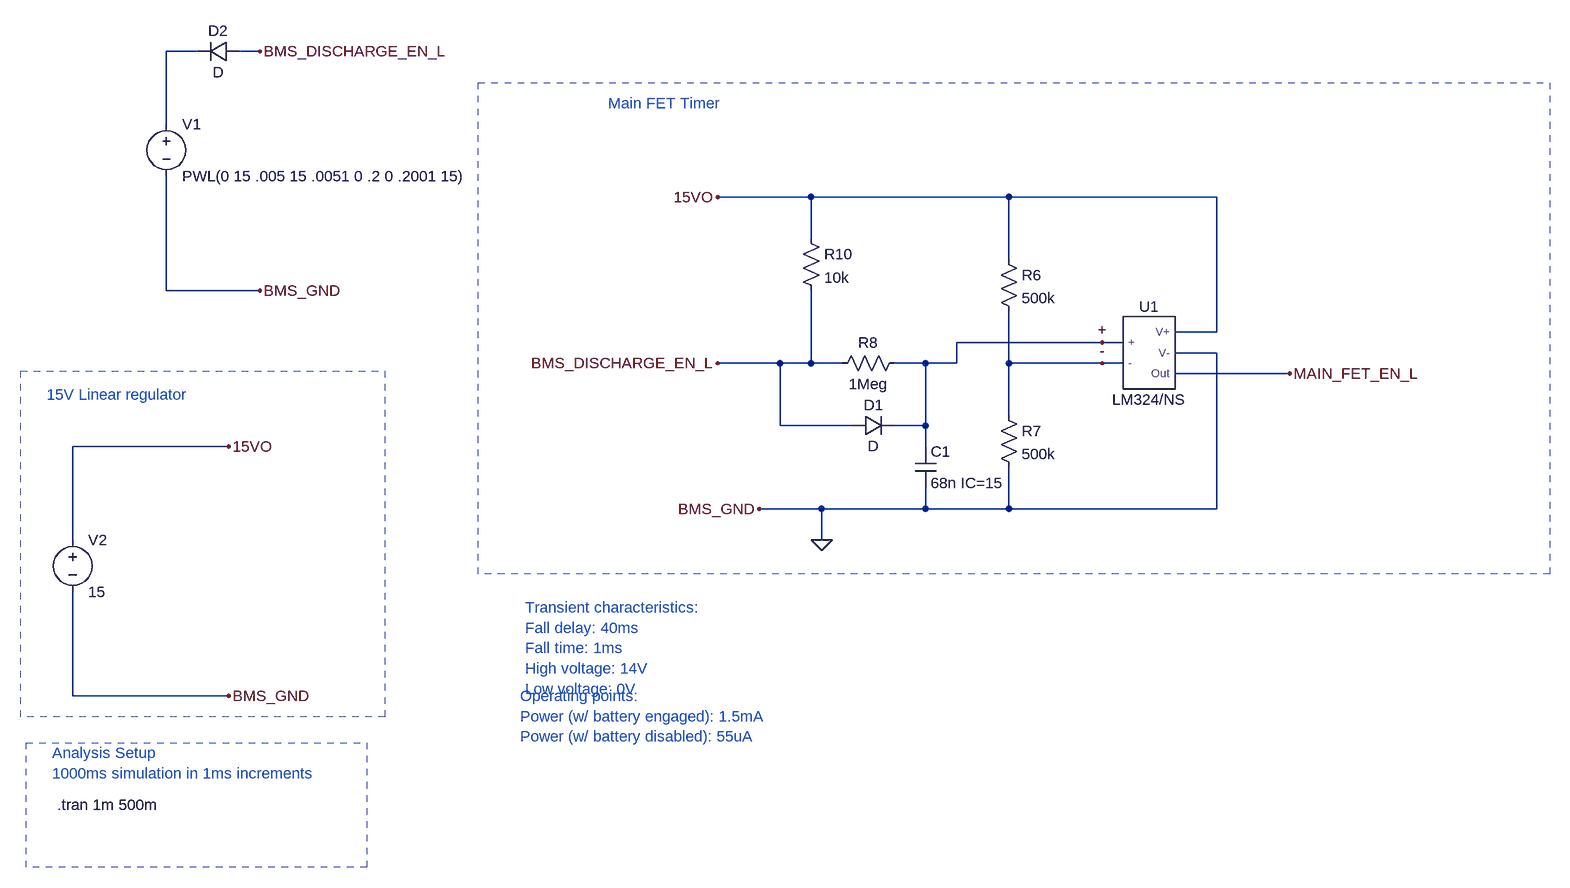
[diagram p0: schematic Main FET Timer.asc]
Main FET Timer.asc, the LTspice schematic file:
Version 4
SHEET 1 5144 2508
WIRE -592 -768 -640 -768
WIRE -496 -768 -528 -768
WIRE -640 -656 -640 -768
WIRE 352 -544 208 -544
WIRE 656 -544 352 -544
WIRE 976 -544 656 -544
WIRE 352 -480 352 -544
WIRE 656 -448 656 -544
WIRE -640 -400 -640 -576
WIRE -496 -400 -640 -400
WIRE 976 -336 976 -544
WIRE 976 -336 912 -336
WIRE 800 -320 576 -320
WIRE 832 -320 800 -320
WIRE 976 -304 912 -304
WIRE 304 -288 208 -288
WIRE 352 -288 352 -400
WIRE 352 -288 304 -288
WIRE 400 -288 352 -288
WIRE 528 -288 480 -288
WIRE 576 -288 576 -320
WIRE 576 -288 528 -288
WIRE 656 -288 656 -368
WIRE 800 -288 656 -288
WIRE 832 -288 800 -288
WIRE 1088 -272 912 -272
WIRE 656 -208 656 -288
WIRE 304 -192 304 -288
WIRE 416 -192 304 -192
WIRE 528 -192 528 -288
WIRE 528 -192 480 -192
WIRE -544 -160 -784 -160
WIRE 528 -160 528 -192
WIRE 368 -64 272 -64
WIRE 528 -64 528 -96
WIRE 528 -64 368 -64
WIRE 656 -64 656 -128
WIRE 656 -64 528 -64
WIRE 976 -64 976 -304
WIRE 976 -64 656 -64
WIRE -784 -16 -784 -160
WIRE 368 -16 368 -64
WIRE -784 224 -784 64
WIRE -544 224 -784 224
FLAG 208 -544 15VO
FLAG 208 -288 BMS_DISCHARGE_EN_L
FLAG 1088 -272 MAIN_FET_EN_L
FLAG -544 -160 15VO
FLAG 272 -64 BMS_GND
FLAG -544 224 BMS_GND
FLAG -496 -768 BMS_DISCHARGE_EN_L
FLAG -496 -400 BMS_GND
FLAG 368 -16 0
FLAG 800 -320 +
FLAG 800 -288 -
SYMBOL res 640 -464 R0
SYMATTR InstName R6
SYMATTR Value 500k
SYMBOL res 640 -224 R0
SYMATTR InstName R7
SYMATTR Value 500k
SYMBOL res 496 -304 R90
WINDOW 0 0 56 VBottom 2
WINDOW 3 32 56 VTop 2
SYMATTR InstName R8
SYMATTR Value 1Meg
SYMBOL cap 512 -160 R0
SYMATTR InstName C1
SYMATTR Value 68n IC=15
SYMBOL diode 416 -176 R270
WINDOW 0 32 32 VTop 2
WINDOW 3 0 32 VBottom 2
SYMATTR InstName D1
SYMBOL res 336 -496 R0
SYMATTR InstName R10
SYMATTR Value 10k
SYMBOL voltage -784 -32 R0
SYMATTR InstName V2
SYMATTR Value 15
SYMBOL diode -528 -784 R90
WINDOW 0 0 32 VBottom 2
WINDOW 3 32 32 VTop 2
SYMATTR InstName D2
SYMBOL AutoGenerated/LM324_NS 864 -304 R0
SYMATTR InstName U1
SYMBOL voltage -640 -672 R0
SYMATTR InstName V1
SYMATTR Value PWL(0 15 .005 15 .0051 0 .2 0 .2001 15)
TEXT -808 392 Left 2 !.tran 1m 500m
TEXT 40 -688 Left 2 ;Main FET Timer
TEXT -816 312 Left 2 ;Analysis Setup\n1000ms simulation in 1ms increments
TEXT -824 -240 Left 2 ;15V Linear regulator
TEXT -88 88 Left 2 ;Transient characteristics:\nFall delay: 40ms\nFall time: 1ms\nHigh voltage: 14V\nLow voltage: 0V
TEXT -96 224 Left 2 ;Operating points:\nPower (w/ battery engaged): 1.5mA\nPower (w/ battery disabled): 55uA
RECTANGLE Normal -160 -720 1488 36 2
RECTANGLE Normal -856 296 -332 488 2
RECTANGLE Normal -864 -276 -304 256 2

The netlist it stands for:
* Main FET Timer.asc
R6 15VO - 500k
R7 - 0 500k
R8 + BMS_DISCHARGE_EN_L 1Meg
C1 + 0 68n IC=15
D1 BMS_DISCHARGE_EN_L + D
R10 15VO BMS_DISCHARGE_EN_L 10k
V2 15VO 0 15
D2 BMS_DISCHARGE_EN_L N001 D
XU1 + - 15VO 0 MAIN_FET_EN_L LM324/NS  ; pins + - V+ V- Out
V1 N001 0 PWL(0 15 .005 15 .0051 0 .2 0 .2001 15)
.model D D
.lib standard.dio
.tran 1m 500m
* Main FET Timer
* Analysis Setup
* 1000ms simulation in 1ms increments
* 15V Linear regulator
* Transient characteristics:
* Fall delay: 40ms
* Fall time: 1ms
* High voltage: 14V
* Low voltage: 0V
* Operating points:
* Power (w/ battery engaged): 1.5mA
* Power (w/ battery disabled): 55uA
.lib /Users/jmassucco17/Documents/Northeastern/Past Semesters/2016 Fall/Paradigm/full_electrical/BatteryBoard/Simulation/Main FET Timer/LM324.MOD
.backanno
.end